# EAGLE design versi.satu (EAGLE 9.6.2)
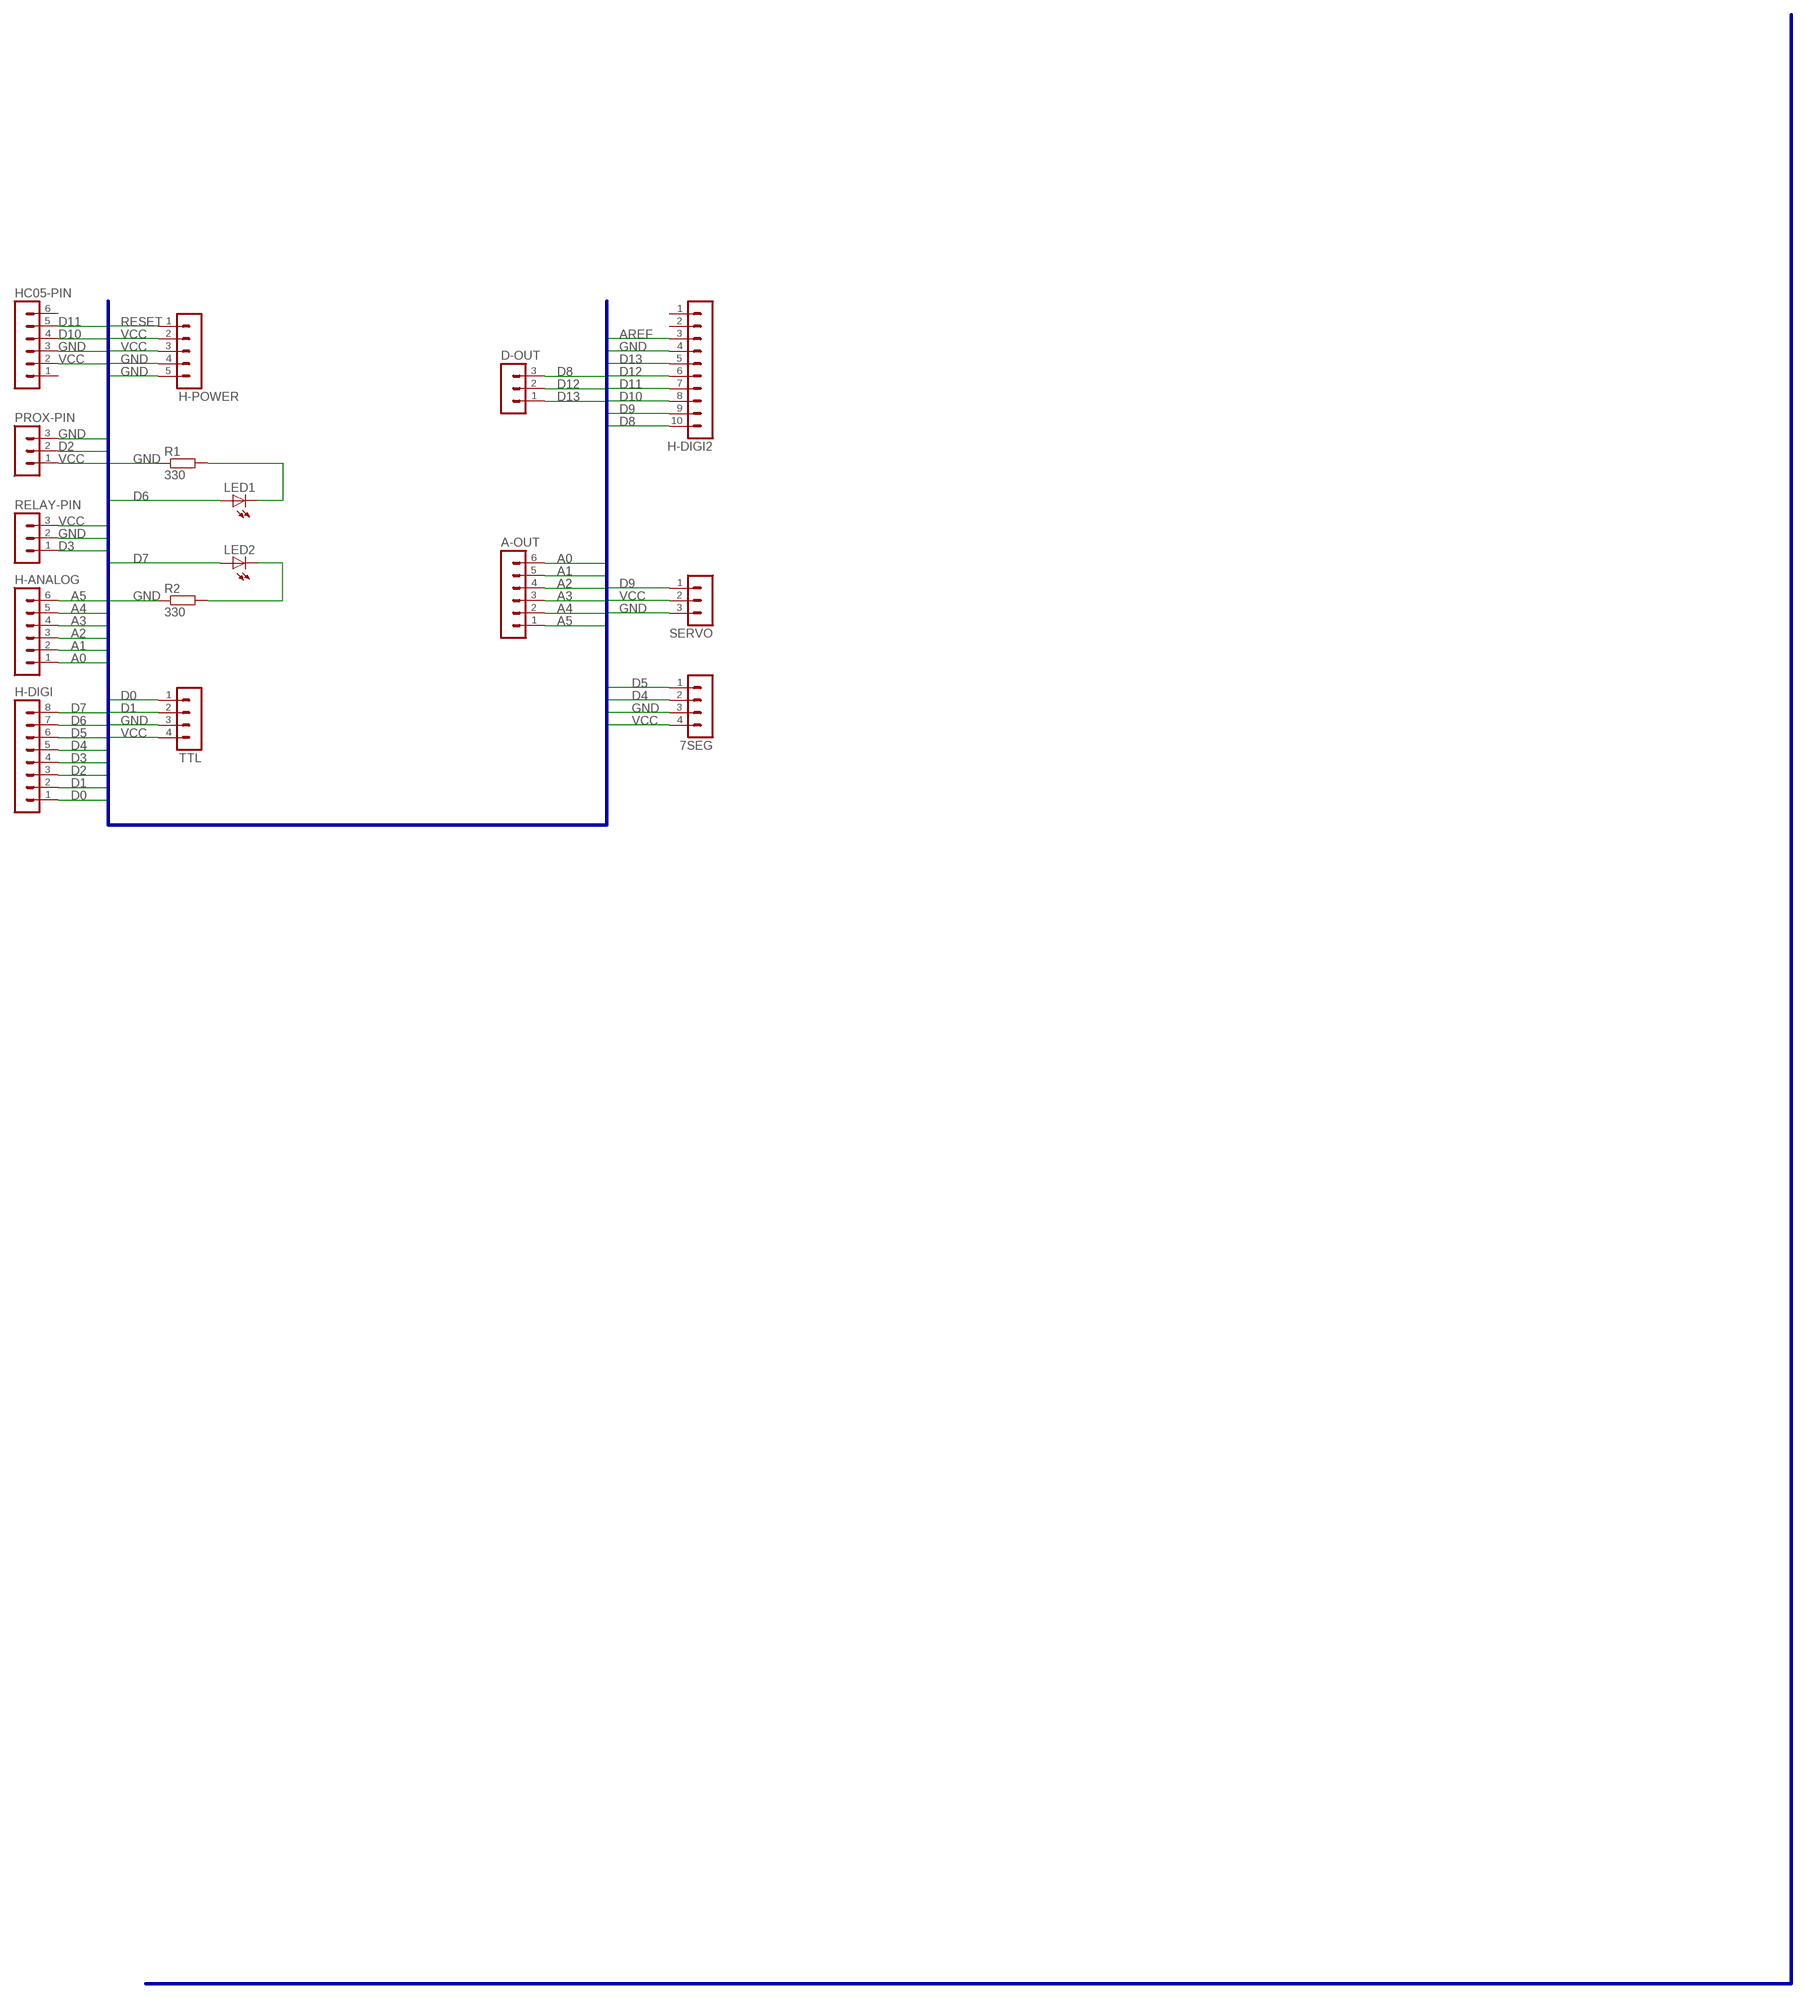
[diagram p0: schematic, sheet 1]

## Parts
7SEG  MA04-1  [MA04-1]
A-OUT  MA06-1  [MA06-1]
D-OUT  MA03-1  [MA03-1]
H-ANALOG  MA06-1  [MA06-1]
H-DIGI  MA08-1  [MA08-1]
H-DIGI2  MA10-1  [MA10-1]
H-POWER  MA05-1  [MA05-1]
HC05-PIN  MA06-1  [MA06-1]
LED1  LED5MM  [LED5MM]
LED2  LED5MM  [LED5MM]
PROX-PIN  MA03-1  [MA03-1]
R1  330  R-EU_0207/10  [0207/10]
R2  330  R-EU_0207/10  [0207/10]
RELAY-PIN  MA03-1  [MA03-1]
SERVO  MA03-1  [MA03-1]
TTL  MA04-1  [MA04-1]

## Nets
A0: A-OUT.6 H-ANALOG.1
A1: A-OUT.5 H-ANALOG.2
A2: A-OUT.4 H-ANALOG.3
A3: A-OUT.3 H-ANALOG.4
A4: A-OUT.2 H-ANALOG.5
A5: A-OUT.1 H-ANALOG.6
AREF: H-DIGI2.3
D0: H-DIGI.1 TTL.1
D1: H-DIGI.2 TTL.2
D2: H-DIGI.3 PROX-PIN.2
D3: H-DIGI.4 RELAY-PIN.1
D4: 7SEG.2 H-DIGI.5
D5: 7SEG.1 H-DIGI.6
D6: H-DIGI.7 LED1.A
D7: H-DIGI.8 LED2.A
D8: D-OUT.3 H-DIGI2.10
D9: H-DIGI2.9 SERVO.1
D10: H-DIGI2.8 HC05-PIN.4
D11: H-DIGI2.7 HC05-PIN.5
D12: D-OUT.2 H-DIGI2.6
D13: D-OUT.1 H-DIGI2.5
GND: 7SEG.3 H-DIGI2.4 H-POWER.4 H-POWER.5 HC05-PIN.3 PROX-PIN.3 R1.1 R2.1 RELAY-PIN.2 SERVO.3 TTL.3
N$1: LED2.K(C) R2.2
N$2: LED1.K(C) R1.2
RESET: H-POWER.1
VCC: 7SEG.4 H-POWER.2 H-POWER.3 HC05-PIN.2 PROX-PIN.1 RELAY-PIN.3 SERVO.2 TTL.4
Unconnected: H-DIGI2.1 H-DIGI2.2 HC05-PIN.1 HC05-PIN.6

## Buses
A[0..5],AREF,AVCC,D[0..13],GND,NC,RESET,VCC,XTAL1,XTAL2

## Library data of the parts
7SEG TTL = con-lstb:MA04-1: PIN HEADER; OC_FARNELL: unknown; OC_NEWARK: unknown
A-OUT H-ANALOG HC05-PIN = con-lstb:MA06-1: PIN HEADER; OC_FARNELL: unknown; OC_NEWARK: unknown
D-OUT PROX-PIN RELAY-PIN SERVO = con-lstb:MA03-1: PIN HEADER; OC_FARNELL: unknown; OC_NEWARK: unknown
H-DIGI = con-lstb:MA08-1: PIN HEADER; OC_FARNELL: unknown; OC_NEWARK: unknown
H-DIGI2 = con-lstb:MA10-1: PIN HEADER; OC_FARNELL: unknown; OC_NEWARK: unknown
H-POWER = con-lstb:MA05-1: PIN HEADER; OC_FARNELL: unknown; OC_NEWARK: unknown
LED1 LED2 = adafruit:LED: LED OSRAM: - CHIPLED LG R971, LG N971, LY N971, LG Q971, LY Q971, LO R971, LY R971 LH N974, LH R974 LS Q976, LO Q976, LY Q976 LO Q996 - Hyper CHIPLED LW Q18S LB Q993, LB Q99A, LB R99A - SideLED LS A670, LO A670, LY A670, LG A670, LP A670 LB A673, LV A673, LT A673, LW A673 LH A674 LY A675 LS A676, LA A676, LO A676, LY A676, LW A676 LS A679, LY A679, LG A679 - Hyper Micro SIDELED® LS Y876, LA Y876, LO Y876, LY Y876 LT Y87S - SmartLED LW L88C, LW L88S LB L89C, LB L89S, LG L890 LS L89K, LO L89K, LY L89K LS L896, LA L896, LO L896, LY L896 - TOPLED LS T670, LO T670, LY T670, LG T670, LP T670 LSG T670, LSP T670, LSY T670, LOP T670, LYG T670 LG T671, LOG T671, LSG T671 LB T673, LV T673, LT T673, LW T673 LH T674 LS T676, LA T676, LO T676, LY T676, LB T676, LH T676, LSB T676, LW T676 LB T67C, LV T67C, LT T67C, LS T67K, LO T67K, LY T67K, LW E67C LS E67B, LA E67B, LO E67B, LY E67B, LB E67C, LV E67C, LT E67C LW T67C LS T679, LY T679, LG T679 LS T770, LO T770, LY T770, LG T770, LP T770 LB T773, LV T773, LT T773, LW T773 LH T774 LS E675, LA E675, LY E675, LS T675 LS T776, LA T776, LO T776, LY T776, LB T776 LHGB T686 LT T68C, LB T68C - Hyper Mini TOPLED® LB M676 - Mini TOPLED Santana® LG M470 LS M47K, LO M47K, LY M47K Source: http://www.osram.convergy.de/
R1 R2 = rcl:R-EU_: RESISTOR, European symbol; SPICEPREFIX: R

## Board
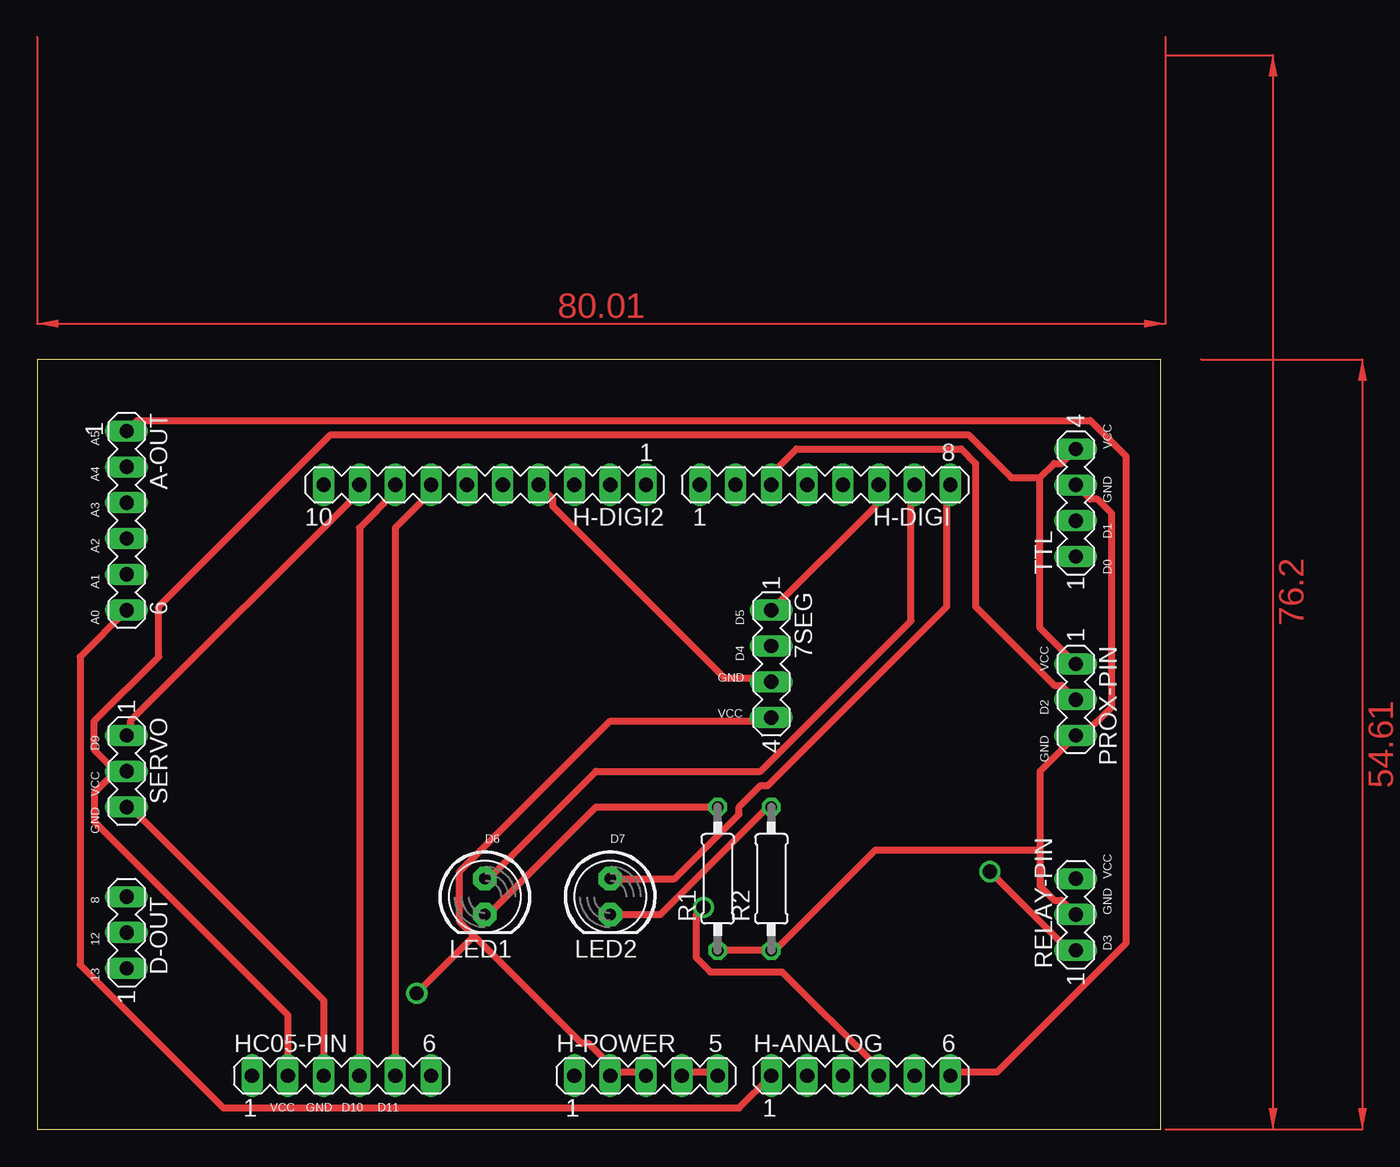
[diagram p1: board, top side]
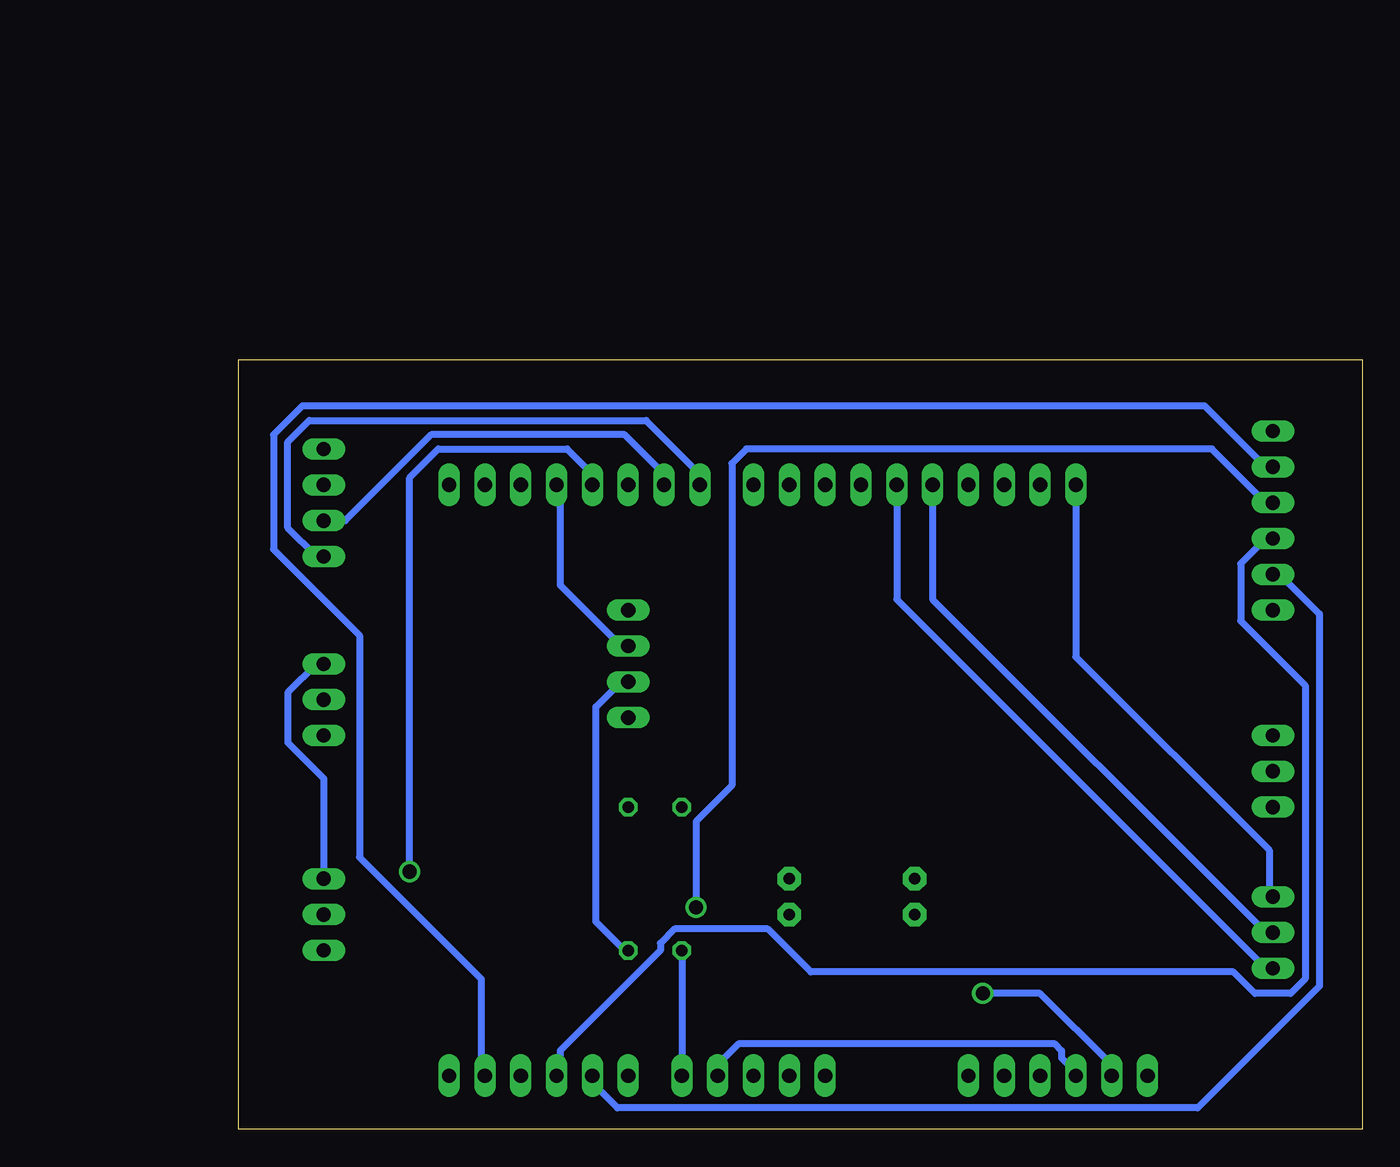
[diagram p2: board, bottom side, seen from below]

Size 79.68 x 54.6 mm. Coordinates in mm from the lower left corner, seen from the top.
Outline: 0,0 79.68,0 79.68,54.6 0,54.6 0,0
Copper layers (1*16): Top 0.035mm / dielectric 1.5mm / Bottom 0.035mm
Design rules "default *": minimum track width 20mil, minimum drill 1mm, track to track 20mil, track to pad 20mil, pad to pad 20mil, via to via 20mil, smd to smd 20mil, copper to edge 40mil, drill to drill 6mil, minimum pad ring 10mil, minimum via ring 8mil, stop-mask expansion 4mil, vias tented up to drill 0mil, thermal gap 10mil

### Footprints (pad centres in the part's own frame; a part is rotated, then mirrored left to right if it is on the bottom)
MA04-1 = drill 1.016 long: 1 -3.81,0; 2 -1.27,0; 3 1.27,0; 4 3.81,0
MA06-1 = drill 1.016 long: 1 -6.35,0; 2 -3.81,0; 3 -1.27,0; 4 1.27,0; 5 3.81,0; 6 6.35,0
MA03-1 = drill 1.016 long: 1 -2.54,0; 2 0,0; 3 2.54,0
MA08-1 = drill 1.016 long: 1 -8.89,0; 2 -6.35,0; 3 -3.81,0; 4 -1.27,0; 5 1.27,0; 6 3.81,0; 7 6.35,0; 8 8.89,0
MA10-1 = drill 1.016 long: 1 -11.43,0; 2 -8.89,0; 3 -6.35,0; 4 -3.81,0; 5 -1.27,0; 6 1.27,0; 7 3.81,0; 8 6.35,0; 9 8.89,0; 10 11.43,0
MA05-1 = drill 1.016 long: 1 -5.08,0; 2 -2.54,0; 3 0,0; 4 2.54,0; 5 5.08,0
LED5MM = drill 0.813 pad 1.676 octagon: A -1.27,0; K 1.27,0
0207/10 = drill 0.813 octagon: 1 -5.08,0; 2 5.08,0

### Placement (x,y rotation side)
7SEG  52.07,33.02 270 top
A-OUT  6.35,43.18 270 top
D-OUT  6.35,13.97 90 top
H-ANALOG  58.42,3.81 0 top
H-DIGI  55.88,45.72 0 top
H-DIGI2  31.75,45.72 180 top
H-POWER  43.18,3.81 0 top
HC05-PIN  21.59,3.81 0 top
LED1  31.75,16.51 270 top
LED2  40.64,16.51 270 top
PROX-PIN  73.66,30.48 270 top
R1  48.26,17.78 90 top
R2  52.07,17.78 90 top
RELAY-PIN  73.66,15.24 90 top
SERVO  6.35,25.4 270 top
TTL  73.66,44.45 90 top

### Tracks (layer width: path | path; a pad name or v marks a point on that pad's centre or on a via)
A0
  Top 0.508: H-ANALOG.1 49.78,1.52 13.21,1.52 3.05,11.68 3.05,33.53 A-OUT.6
A1
  Bottom 0.508: H-ANALOG.2 54.36,3.56 54.36,3.05 52.83,1.52 11.68,1.52 3.05,10.16 3.05,36.58 6.1,39.62 A-OUT.5
A2
  Bottom 0.508: H-ANALOG.3 56.9,4.06 56.9,5.59 49.78,12.7 49.78,13.21 48.77,14.22 42.16,14.22 39.12,11.18 9.14,11.18 7.62,9.65 5.08,9.65 4.06,10.67 4.06,31.5 8.64,36.07 8.64,40.13 6.6,42.16 A-OUT.4
A3  (via drill 1)
  Top 0.508: v47.24,15.75 46.74,15.24 46.74,12.19 47.75,11.18 52.83,11.18 59.44,4.57 59.44,4.06 H-ANALOG.4
  Bottom 0.508: v47.24,15.75 47.24,21.84 44.7,24.38 44.7,47.24 43.69,48.26 10.67,48.26 6.6,44.2 A-OUT.3
A4
  Bottom 0.508: H-ANALOG.5 62.48,4.06 62.48,10.67 71.12,19.3 71.12,35.05 77.22,41.15 77.22,49.28 75.18,51.31 11.18,51.31 6.6,46.74 A-OUT.2
A5
  Top 0.508: A-OUT.1 7.11,50.29 74.68,50.29 77.22,47.75 77.22,13.21 68.07,4.06 65.02,4.06 H-ANALOG.6
D0
  Bottom 0.508: TTL.1 74.17,40.64 76.2,42.67 76.2,48.77 74.68,50.29 50.8,50.29 47.24,46.74 47.24,45.72 H-DIGI.1
D1
  Bottom 0.508: TTL.2 72.14,43.18 66.04,49.28 52.32,49.28 49.78,46.74 49.78,45.72 H-DIGI.2
D2
  Top 0.508: PROX-PIN.2 72.64,31.5 72.14,31.5 66.55,37.08 66.55,47.24 65.53,48.26 53.85,48.26 52.32,46.74 52.32,45.72 H-DIGI.3
D3  (via drill 1)
  Top 0.508: v67.56,18.29 73.15,12.7 RELAY-PIN.1
  Bottom 0.508: v67.56,18.29 67.56,46.23 65.53,48.26 56.39,48.26 54.86,46.74 54.86,45.72 H-DIGI.4
D4
  Bottom 0.508: 7SEG.2 52.32,34.54 52.83,34.54 56.9,38.61 56.9,45.72 H-DIGI.5
D5
  Top 0.508: 7SEG.1 59.44,44.2 59.44,45.72 H-DIGI.6
D6
  Top 0.508: H-DIGI.7 61.98,45.72 61.98,36.07 51.31,25.4 39.62,25.4 32,17.78 LED1.A
D7
  Top 0.508: LED2.A 45.21,17.78 49.78,22.35 49.78,22.86 51.31,24.38 51.82,24.38 64.52,37.08 64.52,45.72 H-DIGI.8
D8
  Bottom 0.508: H-DIGI2.10 20.32,33.53 6.6,19.81 6.6,16.76 D-OUT.3
D9
  Top 0.508: H-DIGI2.9 22.86,45.21 6.6,28.96 6.6,27.94 SERVO.1
D10
  Top 0.508: HC05-PIN.4 22.86,42.67 25.4,45.21 H-DIGI2.8
D11
  Top 0.508: HC05-PIN.5 25.4,42.67 27.94,45.21 H-DIGI2.7
D12
  Bottom 0.508: H-DIGI2.6 30.48,37.59 7.11,14.22 6.6,14.22 D-OUT.2
D13
  Bottom 0.508: H-DIGI2.5 33.02,37.59 7.11,11.68 6.6,11.68 D-OUT.1
GND
  Top 0.508: HC05-PIN.3 20.32,9.14 6.6,22.86 SERVO.3 | RELAY-PIN.2 72.64,16.26 72.14,16.26 71.12,17.27 71.12,19.81 | 71.12,19.81 71.12,25.4 PROX-PIN.3 74.17,27.94 76.2,29.97 76.2,43.69 75.18,44.7 74.68,44.7 TTL.3 | H-POWER.4 45.72,4.06 48.26,4.06 H-POWER.5 | R1.1 R2.1 52.32,12.7 59.44,19.81 71.12,19.81 | H-DIGI2.4 36.58,44.7 36.58,44.2 48.77,32 51.82,32 7SEG.3
  Bottom 0.508: 7SEG.3 52.32,31.5 52.83,31.5 54.36,29.97 54.36,14.73 52.32,12.7 R2.1 | R1.1 H-POWER.5 | H-POWER.4 45.72,4.57 44.2,6.1 21.84,6.1 21.34,5.59 21.34,5.08 20.32,4.06 HC05-PIN.3
N$1
  Top 0.508: LED2.K 44.2,15.24 51.82,22.86 R2.2
N$2
  Top 0.508: R1.2 39.62,22.86 32,15.24 LED1.K
VCC  (via drill 1)
  Top 0.508: 41.15,4.06 43.18,4.06 H-POWER.3 | 41.15,4.06 40.64,4.06 H-POWER.2 41.15,4.06 | 30.99,13.72 38.61,6.1 39.12,6.1 41.15,4.06 | 30.99,13.72 29.97,14.73 29.97,18.29 40.64,28.96 51.82,28.96 7SEG.4 | TTL.4 72.64,47.24 72.14,47.24 71.12,46.23 | 71.12,46.23 71.12,35.56 PROX-PIN.1 | HC05-PIN.2 17.78,8.13 4.06,21.84 4.06,23.88 5.59,25.4 | 5.59,25.4 SERVO.2 6.1,25.4 | 71.12,46.23 69.09,46.23 66.04,49.28 20.83,49.28 8.64,37.08 8.64,33.53 4.06,28.96 4.06,26.92 5.59,25.4 | v26.92,9.65 30.99,13.72
  Bottom 0.508: RELAY-PIN.3 73.66,24.89 76.2,27.43 76.2,30.99 74.17,33.02 PROX-PIN.1 | v26.92,9.65 22.86,9.65 17.78,4.57 HC05-PIN.2
(copper drawn outside any net)
  shapes: Top area x3

### Text on the board
tNames: A5 | VCC | A4 | A3 | GND | A2 | D1 | A1 | D0 | A0 | D5 | D4 | VCC | GND | D2 | VCC | D9 | GND | VCC | GND | D6 | D7 | VCC | 8 | GND | 12 | D3 | 13 | VCC | GND | D10 | D11